# EAGLE design ADG736-Breakout (EAGLE 7.7.0)
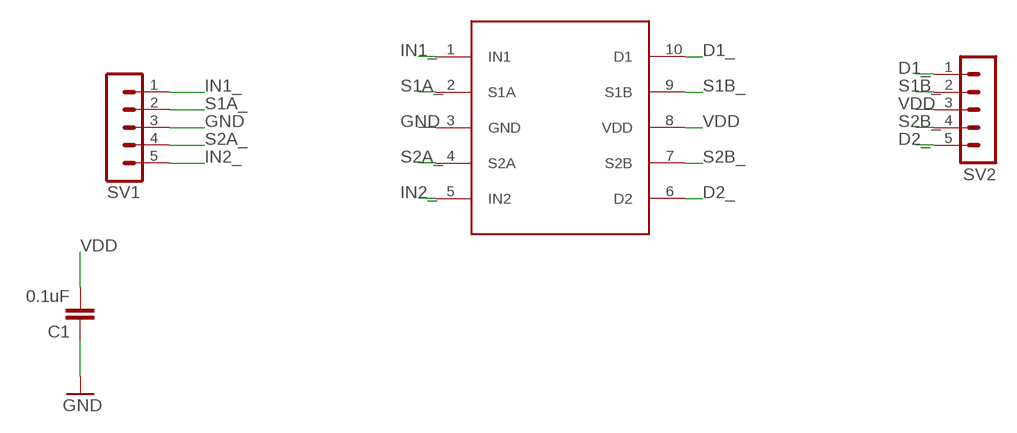
[diagram p0: schematic, sheet 1]

## Parts
C1  0.1uF  C-EUC0805  [C0805]
SV1  MA05-1  [MA05-1]
SV2  MA05-1  [MA05-1]
U$1  ADG736  [ADG736]

## Nets
D1_: SV2.1 U$1.10(D1)
D2_: SV2.5 U$1.6(D2)
GND: C1.1 SV1.3 U$1.3(GND)
IN1_: SV1.1 U$1.1(IN1)
IN2_: SV1.5 U$1.5(IN2)
S1A_: SV1.2 U$1.2(S1A)
S1B_: SV2.2 U$1.9(S1B)
S2A_: SV1.4 U$1.4(S2A)
S2B_: SV2.4 U$1.7(S2B)
VDD: C1.2 SV2.3 U$1.8(VDD)

## Library data of the parts
C1 = rcl:C-EU: CAPACITOR, European symbol
SV1 SV2 = con-lstb:MA05-1: PIN HEADER; OC_FARNELL: unknown; OC_NEWARK: unknown
U$1 = ADG736:ADG736: The ADG736 is a monolithic device comprising two independ- ently selectable CMOS single pole, double throw (SPDT) switches. These switches are designed using a submicron process that provides low power dissipation yet gives high switching speed, low on resistance, low leakage currents, and wide input signal bandwidth.

## Board
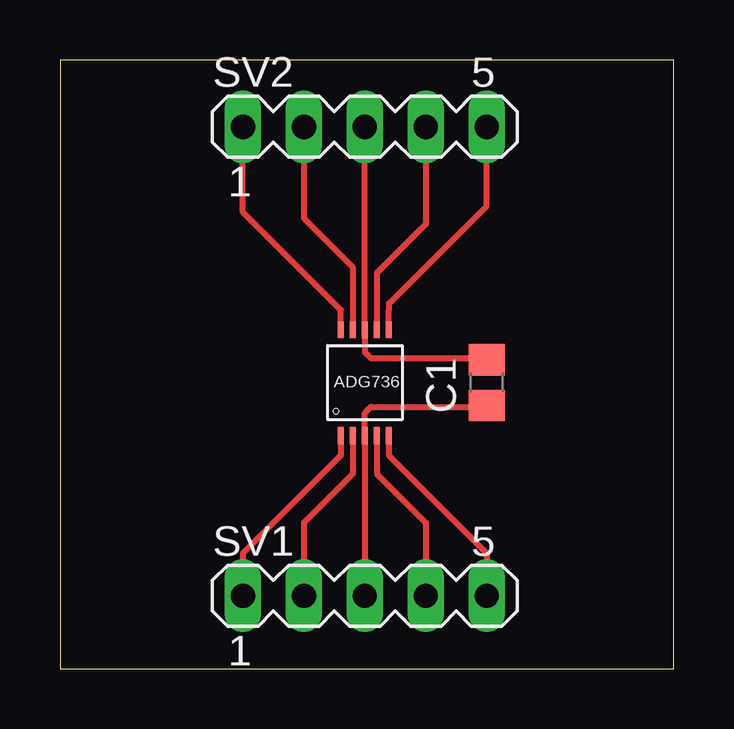
[diagram p1: board, top side]

Size 25.58 x 25.39 mm. Coordinates in mm from the lower left corner, seen from the top.
Outline: 0,0 25.58,0 25.58,25.39 0,25.39 0,0
Copper layers (1*16): Top 0.035mm / dielectric 1.5mm / Bottom 0.035mm
Design rules "default": minimum track width 10mil, minimum drill 24mil, track to track 8mil, track to pad 8mil, pad to pad 8mil, via to via 8mil, smd to smd 8mil, copper to edge 40mil, drill to drill 8mil, minimum pad ring 10mil, minimum via ring 8mil, stop-mask expansion 4mil, vias tented up to drill 0mil, thermal gap 10mil

### Footprints (pad centres in the part's own frame; a part is rotated, then mirrored left to right if it is on the bottom)
C0805 = smd 1.3 x 1.5: 1 -0.95,0; 2 0.95,0
MA05-1 = drill 1.016 long: 1 -5.08,0; 2 -2.54,0; 3 0,0; 4 2.54,0; 5 5.08,0
ADG736 = smd 0.254 x 0.7: 1 -1,-2.2; 2 -0.5,-2.2; 3 0,-2.2; 4 0.5,-2.2; 5 1,-2.2; 6 1,2.2; 7 0.5,2.2; 8 0,2.2; 9 -0.5,2.2; 10 -1,2.2

### Placement (x,y rotation side)
C1  17.78,11.94 90 top
SV1  12.7,3.05 0 top
SV2  12.7,22.61 0 top
U$1  12.7,11.94 0 top

### Tracks (layer width: path | path; a pad name or v marks a point on that pad's centre or on a via)
D1_
  Top 0.254: U$1.10 11.7,14.97 7.62,19.05 SV2.1
D2_
  Top 0.254: U$1.6 13.7,14.97 13.72,14.99 13.72,15.24 17.78,19.3 SV2.5
GND
  Top 0.254: C1.1 17.71,10.92 12.95,10.92 12.7,10.67 U$1.3 SV1.3
IN1_
  Top 0.254: U$1.1 11.7,8.91 7.62,4.83 SV1.1
IN2_
  Top 0.254: U$1.5 13.7,8.91 17.78,4.83 SV1.5
S1A_
  Top 0.254: U$1.2 12.2,8.14 10.16,6.1 SV1.2
S1B_
  Top 0.254: SV2.2 10.16,18.8 12.19,16.76 U$1.9
S2A_
  Top 0.254: U$1.4 13.2,8.14 15.24,6.1 SV1.4
S2B_
  Top 0.254: SV2.4 15.24,18.54 13.21,16.51 U$1.7
VDD
  Top 0.254: SV2.3 U$1.8 12.7,13.21 12.95,12.95 17.71,12.95 C1.2